# EAGLE design ADXL345_Breakout-v14 (EAGLE 6.4)
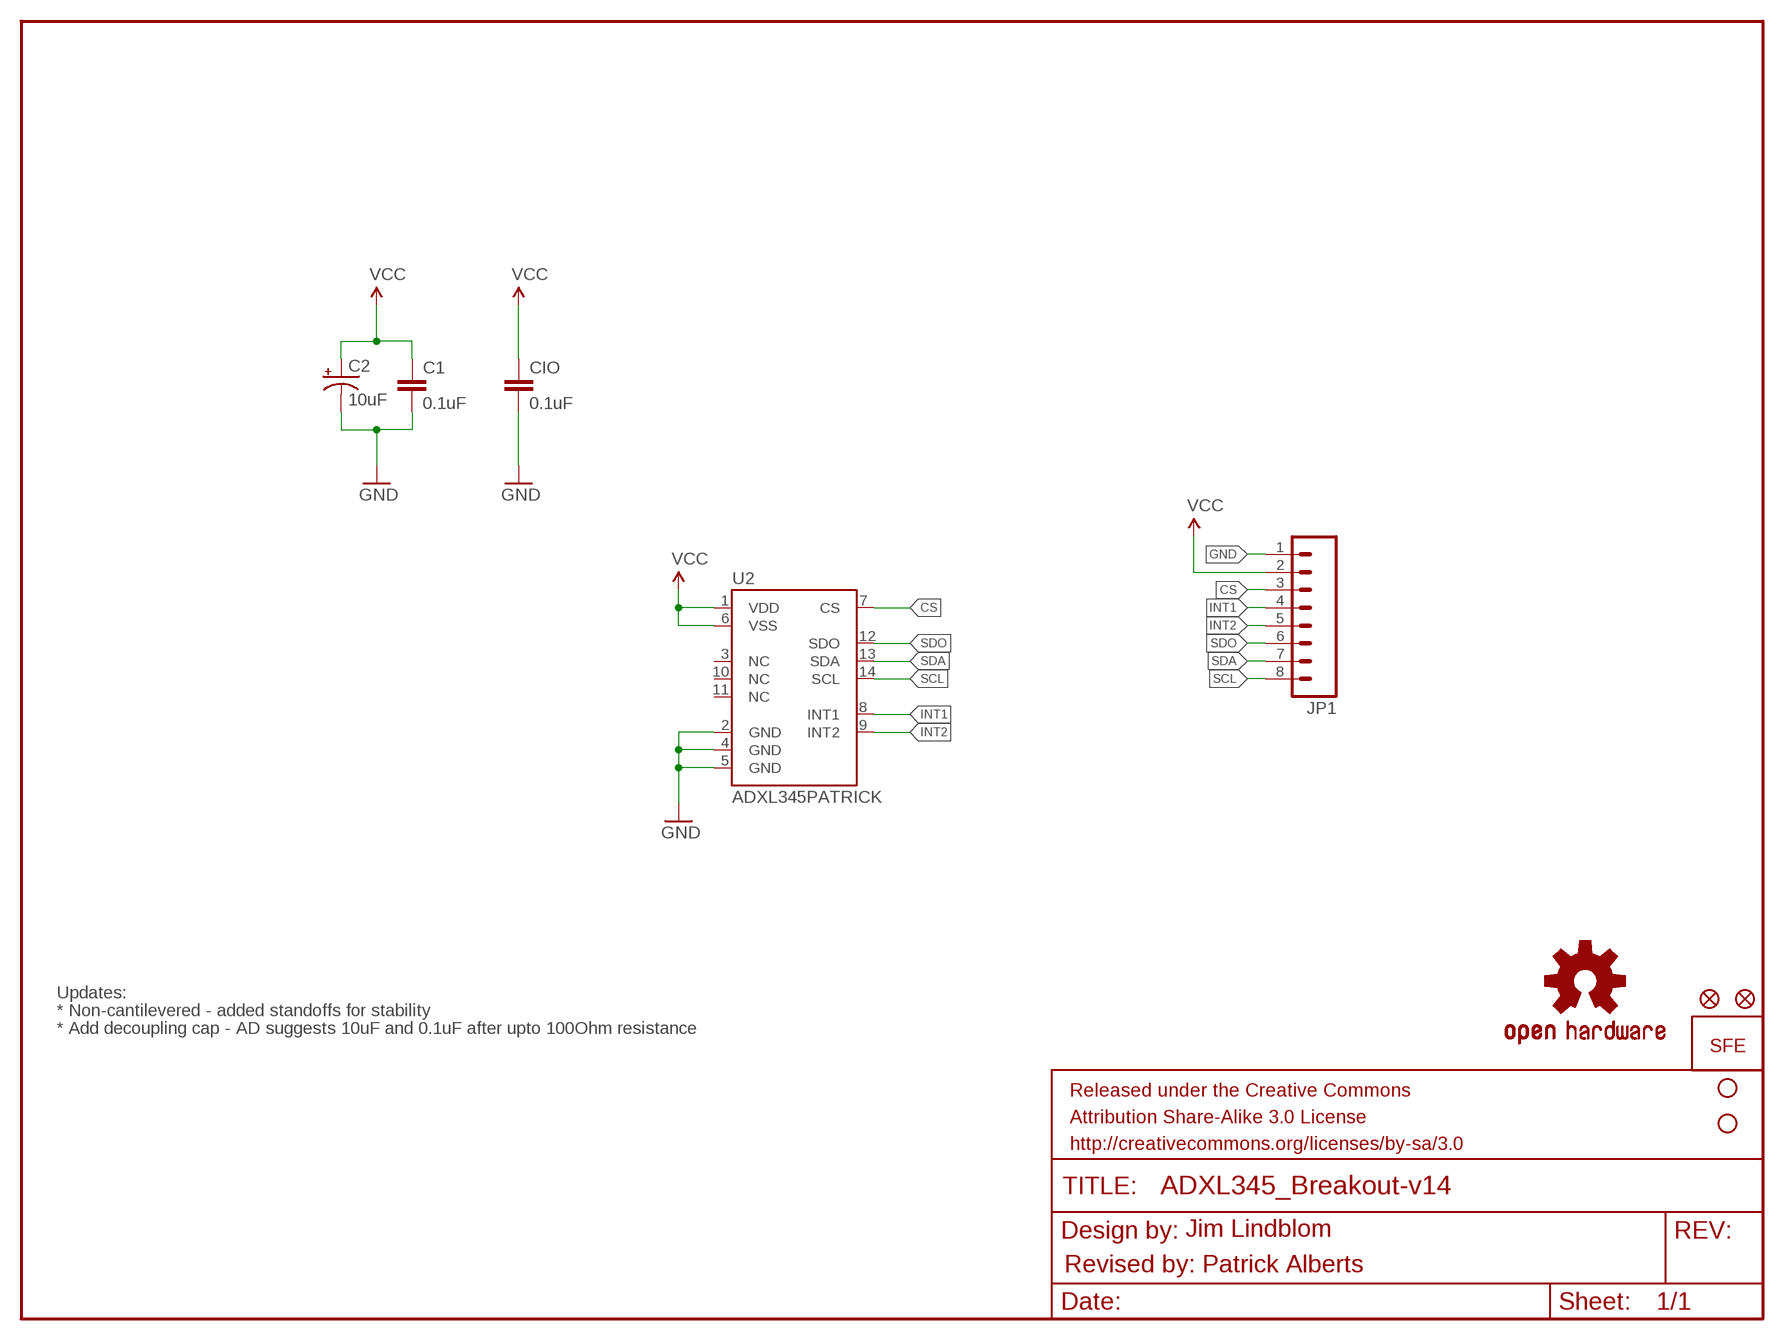
[diagram p0: schematic, sheet 1]

## Parts
C1  0.1uF  CAP0603-CAP  [0603-CAP]
C2  10uF  CAP_POL1206  [EIA3216]
CIO  0.1uF  CAP0603-CAP  [0603-CAP]
JP1  M08  [1X08]
JP2  STAND-OFF  [STAND-OFF]
JP3  STAND-OFF  [STAND-OFF]
JP4  FIDUCIAL1X2  [FIDUCIAL-1X2]
JP5  FIDUCIAL1X2  [FIDUCIAL-1X2]
U2  ADXL345PATRICK  [LGA14_1:1_PATRICK]
U$2  LOGO-SFENEW  [SFE-NEW-WEBLOGO]
U$3  OSHW-LOGOS  [OSHW-LOGO-S]

## Nets
CS: JP1.3 U2.7(CS)
GND: C1.2 C2.C(-) CIO.2 JP1.1 U2.2(GND) U2.4(GND) U2.5(GND)
INT1: JP1.4 U2.8(INT1)
INT2: JP1.5 U2.9(INT2)
SCL: JP1.8 U2.14(SCL)
SDA: JP1.7 U2.13(SDA)
SDO: JP1.6 U2.12(SDO)
VCC: C1.1 C2.A(+) CIO.1 JP1.2 U2.1(VDD) U2.6(VSS)
Unconnected: U2.3(NC) U2.10(NC) U2.11(NC)

## Notes on the sheet
- Updates:
- * Non-cantilevered - added standoffs for stability
- * Add decoupling cap - AD suggests 10uF and 0.1uF after upto 100Ohm resistance
- Jim Lindblom
- Revised by: Patrick Alberts

## Library data of the parts
C1 CIO = SparkFun:CAP: Capacitor Standard 0603 ceramic capacitor, and 0.1" leaded capacitor.
C2 = SparkFun:CAP_POL: Capacitor Polarized These are standard SMD and PTH capacitors. Normally 10uF, 47uF, and 100uF in electrolytic and tantalum varieties. Always verify the external diameter of the through hole cap, it varies with capacity, voltage, and manufacturer. The EIA devices should be standard.
JP1 = SparkFun:M08: Header 8 Standard 8-pin 0.1" header. Use with straight break away headers (SKU : PRT-00116), right angle break away headers (PRT-00553), swiss pins (PRT-00743), machine pins (PRT-00117), and female headers (PRT-00115).
JP2 JP3 = SparkFun:STAND-OFF: Stand Off This is the mechanical footprint for a #4 phillips button head screw. Use the keepout ring to avoid running the screw head into surrounding components. SKU : PRT-00447
JP4 JP5 = SparkFun-Aesthetics:FIDUCIAL: Fiducial Alignment Points Various fiducial points for machine vision alignment.
U2 = Testing:ADXL345
U$2 = SparkFun:LOGO-SFE: Spark Fun Electronics PCB Logo This is the standard Spark Fun Electronics PCB logo.
U$3 = SparkFun-Aesthetics:OSHW-LOGO: Open Source Hardware Logo This logo indicates the piece of hardware it is found on incorporates a OSHW license and/or adheres to the definition of open source hardware found here: http://freedomdefined.org/OSHW

## Board
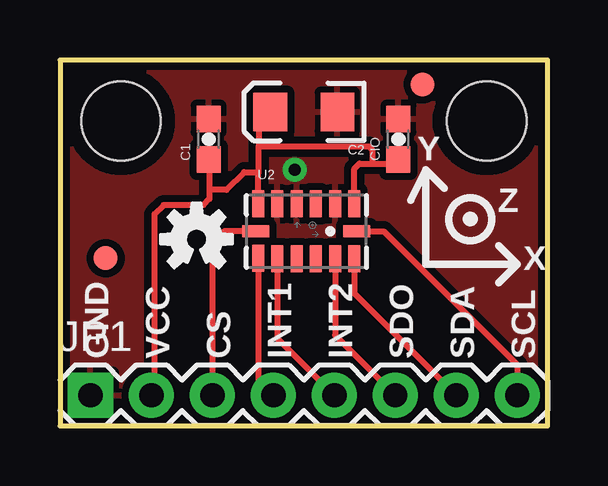
[diagram p1: board, top side]
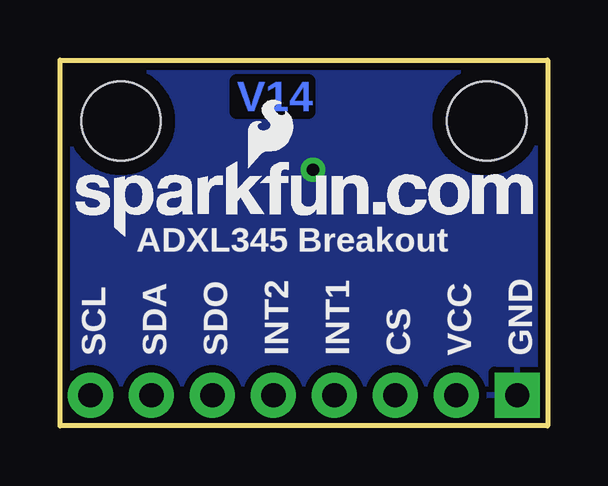
[diagram p2: board, bottom side, seen from below]

Size 20.32 x 15.24 mm. Coordinates in mm from the lower left corner, seen from the top.
Outline: 0,0 20.32,0 20.32,15.24 0,15.24 0,0
Copper layers (1*16): Top 0.035mm / dielectric 1.5mm / Bottom 0.035mm
Design rules "SparkFun *": minimum track width 8mil, minimum drill 20mil, track to track 8mil, track to pad 8mil, pad to pad 8mil, via to via 8mil, smd to smd 8mil, copper to edge 8mil, drill to drill 8mil, minimum pad ring 12mil, minimum via ring 10mil, stop-mask expansion 4mil, vias tented up to drill 20mil, thermal gap 10mil
tRestrict: area 9.3,8.9 to 9.6,9.1; area 10.1,8.9 to 10.4,9.1

### Footprints (pad centres in the part's own frame; a part is rotated, then mirrored left to right if it is on the bottom)
0603-CAP = smd 1.1 x 1: 1 -0.85,0; 2 0.85,0
EIA3216 = smd 1.4 x 1.6: A 1.4,0; C -1.4,0
1X08 = drill 1.016 pad 1.88 square: 1 0,0 | drill 1.016 pad 1.88: 2 2.54,0; 3 5.08,0; 4 7.62,0; 5 10.16,0; 6 12.7,0; 7 15.24,0; 8 17.78,0
STAND-OFF = hole 3.302: 0,0
FIDUCIAL-1X2 = smd 1 x 1: 1 0,0
LGA14_1:1_PATRICK = smd 0.5 x 1.124: 1 2,1.138; 2 1.2,1.138; 3 0.4,1.138; 4 -0.4,1.138; 5 -1.2,1.138; 6 -2,1.138; 8 -2,-1.13; 9 -1.2,-1.138; 10 -0.4,-1.138; 11 0.4,-1.138; 12 1.2,-1.138; 13 2,-1.138 | smd 1.124 x 0.5: 7 -2.1,0; 14 2.1,0

### Placement (x,y rotation side)
C1  6.2,11.94 90 top
C2  10.16,13.08 180 top
CIO  14.1,11.94 90 top
JP1  1.27,1.27 0 top
JP2  2.54,12.7 0 top
JP3  17.78,12.7 0 top
JP4  1.91,6.99 0 top
JP5  15.11,14.22 0 top
U2  10.26,8.1 0 top
U$2  19.68,7.87 0 bottom
U$3  5.69,7.77 0 top

### Tracks (layer width: path | path; a pad name or v marks a point on that pad's centre or on a via)
CS
  Top 0.254: U2.7 6.83,8.1 6.35,7.62 JP1.3
GND  (via drill 0.51)
  other vias: 9.78,10.67
  pour Top (isolate 0.305): 0,0 0,15.24 20.32,15.24 20.32,0
  pour Bottom (isolate 0.305): 0,0 0,15.24 20.32,15.24 20.32,0
INT1
  Top 0.254: U2.8 8.26,1.9 JP1.4
INT2
  Top 0.254: U2.9 9.06,3.64 JP1.5
SCL
  Top 0.254: JP1.8 19.05,2.54 13.49,8.1 U2.14
SDA
  Top 0.254: U2.13 12.26,5.52 JP1.7
SDO
  Top 0.254: U2.12 11.46,3.78 JP1.6
VCC
  Top 0.254: 8.28,11.63 12.88,11.63 13.01,11.51 13.01,10.92 | 8.28,10.54 8.28,11.63 | 8.28,10.54 8.26,10.57 7.67,10.57 6.93,9.83 6.22,9.83 | U2.1 12.26,10.71 12.47,10.92 13.01,10.92 | 13.01,10.92 13.93,10.92 CIO.1 | U2.6 8.26,10.52 8.28,10.54 | C2.A 8.28,13.08 8.28,11.63 | JP1.2 3.94,1.4 3.94,8.81 4.32,9.2 5.97,9.2 6.22,9.45 6.22,9.83 | C1.1 6.22,11.06 6.22,9.83

### Text on the board
Bottom: V14
tPlace: Y | Z | X | GND | VCC | CS | INT1 | INT2 | SDO | SDA | SCL
bPlace: ADXL345 Breakout | GND | VCC | CS | INT1 | INT2 | SDO | SDA | SCL
tNames: J. Lindblom